# EAGLE design 4 Bit To 2 Digit Display (EAGLE 7.6.0)
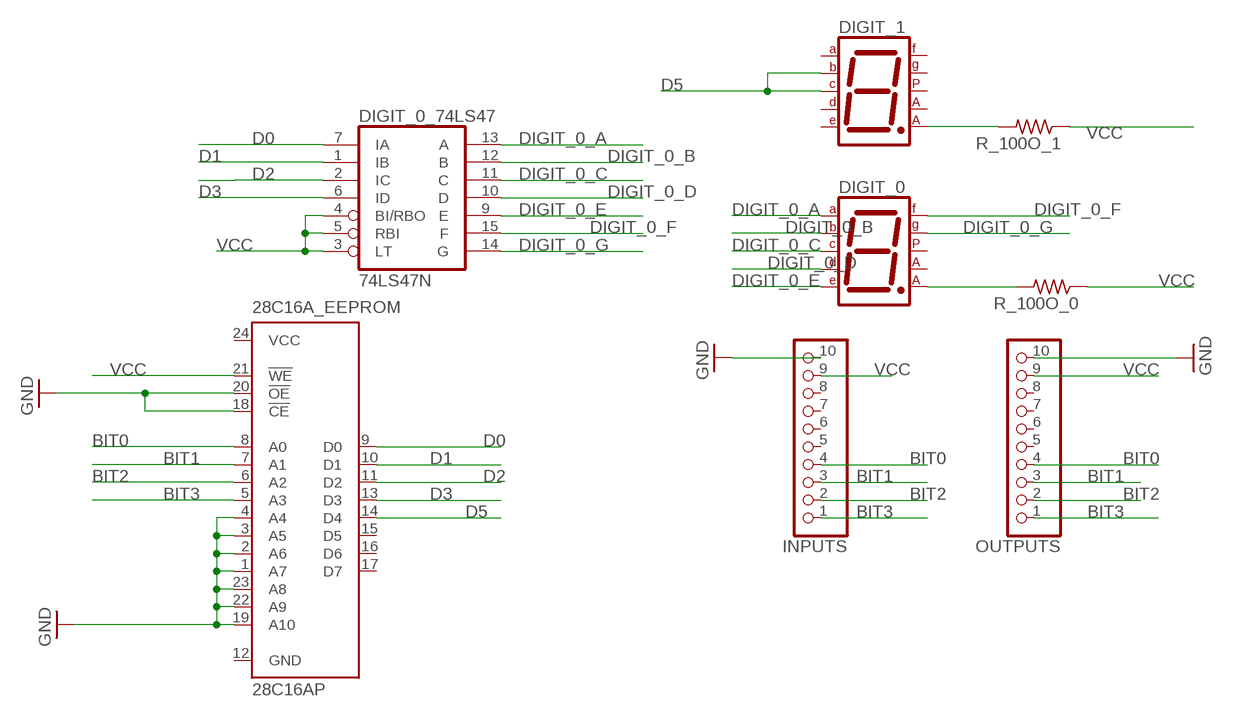
[diagram p0: schematic, sheet 1]

## Parts
28C16A_EEPROM  28C16AP  [DIL24-6]
DIGIT_0  7SEG-CA  [7SEG-13]
DIGIT_0_74LS47  74LS47N  [DIL16]
DIGIT_1  7SEG-CA  [7SEG-13]
INPUTS  PINHD-1X10  [1X10-BIG]
OUTPUTS  PINHD-1X10  [1X10-BIG]
R_100O_0  R-US_R1206  [R1206]
R_100O_1  R-US_R1206  [R1206]

## Nets
BIT0: 28C16A_EEPROM.8(A0) INPUTS.4 OUTPUTS.4
BIT1: 28C16A_EEPROM.7(A1) INPUTS.3 OUTPUTS.3
BIT2: 28C16A_EEPROM.6(A2) INPUTS.2 OUTPUTS.2
BIT3: 28C16A_EEPROM.5(A3) INPUTS.1 OUTPUTS.1
D0: 28C16A_EEPROM.9(D0) DIGIT_0_74LS47.7(IA)
D1: 28C16A_EEPROM.10(D1) DIGIT_0_74LS47.1(IB)
D2: 28C16A_EEPROM.11(D2) DIGIT_0_74LS47.2(IC)
D3: 28C16A_EEPROM.13(D3) DIGIT_0_74LS47.6(ID)
D5: 28C16A_EEPROM.14(D4) DIGIT_1.4(C) DIGIT_1.6(B)
DIGIT_0_A: DIGIT_0.7(A) DIGIT_0_74LS47.13(A)
DIGIT_0_B: DIGIT_0.6(B) DIGIT_0_74LS47.12(B)
DIGIT_0_C: DIGIT_0.4(C) DIGIT_0_74LS47.11(C)
DIGIT_0_D: DIGIT_0.2(D) DIGIT_0_74LS47.10(D)
DIGIT_0_E: DIGIT_0.1(E) DIGIT_0_74LS47.9(E)
DIGIT_0_F: DIGIT_0.9(F) DIGIT_0_74LS47.15(F)
DIGIT_0_G: DIGIT_0.10(G) DIGIT_0_74LS47.14(G)
GND: 28C16A_EEPROM.1(A7) 28C16A_EEPROM.2(A6) 28C16A_EEPROM.3(A5) 28C16A_EEPROM.4(A4) 28C16A_EEPROM.18(!CE) 28C16A_EEPROM.19(A10) 28C16A_EEPROM.20(!OE) 28C16A_EEPROM.22(A9) 28C16A_EEPROM.23(A8) INPUTS.10 OUTPUTS.10
N$1: DIGIT_0.8(CA2) R_100O_0.2
N$2: DIGIT_1.8(CA2) R_100O_1.2
VCC: 28C16A_EEPROM.21(!WE) DIGIT_0_74LS47.3(LT) DIGIT_0_74LS47.4(BI/RBO) DIGIT_0_74LS47.5(RBI) INPUTS.9 OUTPUTS.9 R_100O_0.1 R_100O_1.1
Unconnected: 28C16A_EEPROM.15(D5) 28C16A_EEPROM.16(D6) 28C16A_EEPROM.17(D7) DIGIT_0.3(CA1) DIGIT_0.5(DP) DIGIT_1.1(E) DIGIT_1.2(D) DIGIT_1.3(CA1) DIGIT_1.5(DP) DIGIT_1.7(A) DIGIT_1.9(F) DIGIT_1.10(G) INPUTS.5 INPUTS.6 INPUTS.7 INPUTS.8 OUTPUTS.5 OUTPUTS.6 OUTPUTS.7 OUTPUTS.8

## Power pins joined to a net without a drawn wire
GND: 28C16A_EEPROM.12(GND) DIGIT_0_74LS47.8(GND)
VCC: 28C16A_EEPROM.24(VCC) DIGIT_0_74LS47.16(VCC)

## Library data of the parts
28C16A_EEPROM = microchip:28*16A: CMOS EPROM 16 K (2 K x 8) Source: ww1.microchip.com/downloads/en/DeviceDoc/11125J.pdf; MPN: CAT28C16ALI-12; OC_FARNELL: 1718292; OC_NEWARK: 06R0648
DIGIT_0 DIGIT_1 = special:7SEG-CA: 7-segment DISPLAY single anode, 13 mm
DIGIT_0_74LS47 = 74xx-eu:74*47: BCD to seven segment DECODER/DRIVER Source: http://www.ee.washington.edu/stores/DataSheets/74ls/74ls47.pdf
INPUTS OUTPUTS = adafruit:PINHD-1X10: Pin header 1x10 0.1" spacing With round pins
R_100O_0 R_100O_1 = adafruit:R-US_: RESISTOR, American symbol

## Board
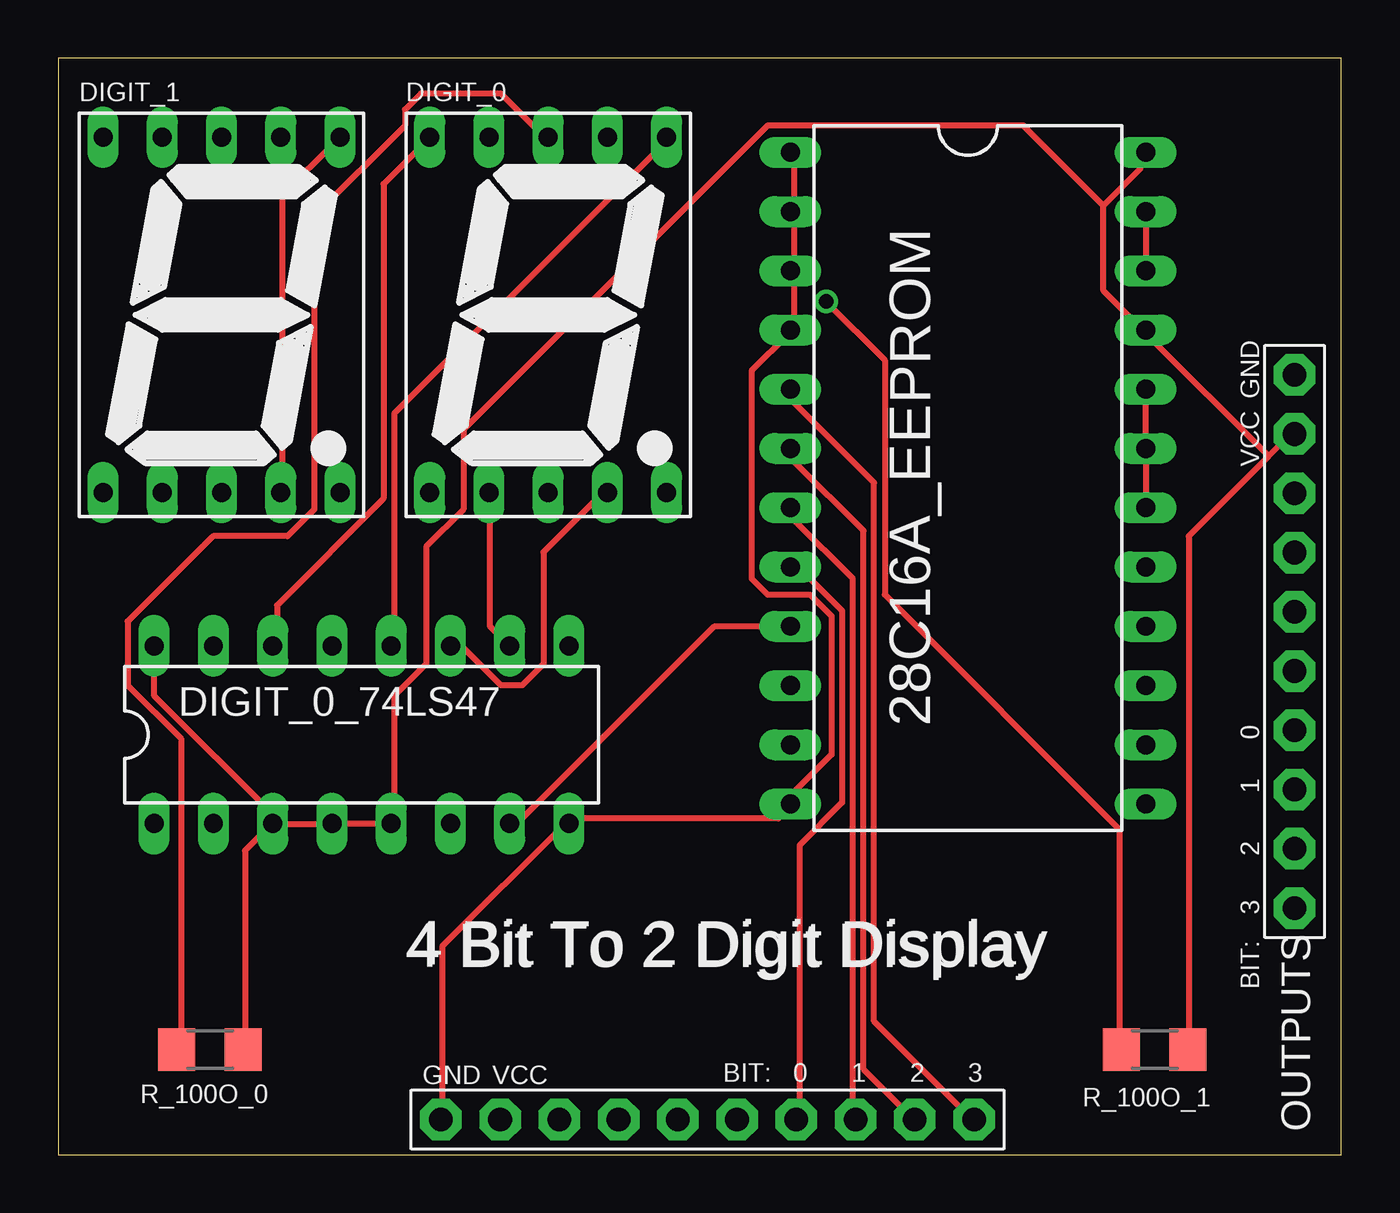
[diagram p1: board, top side]
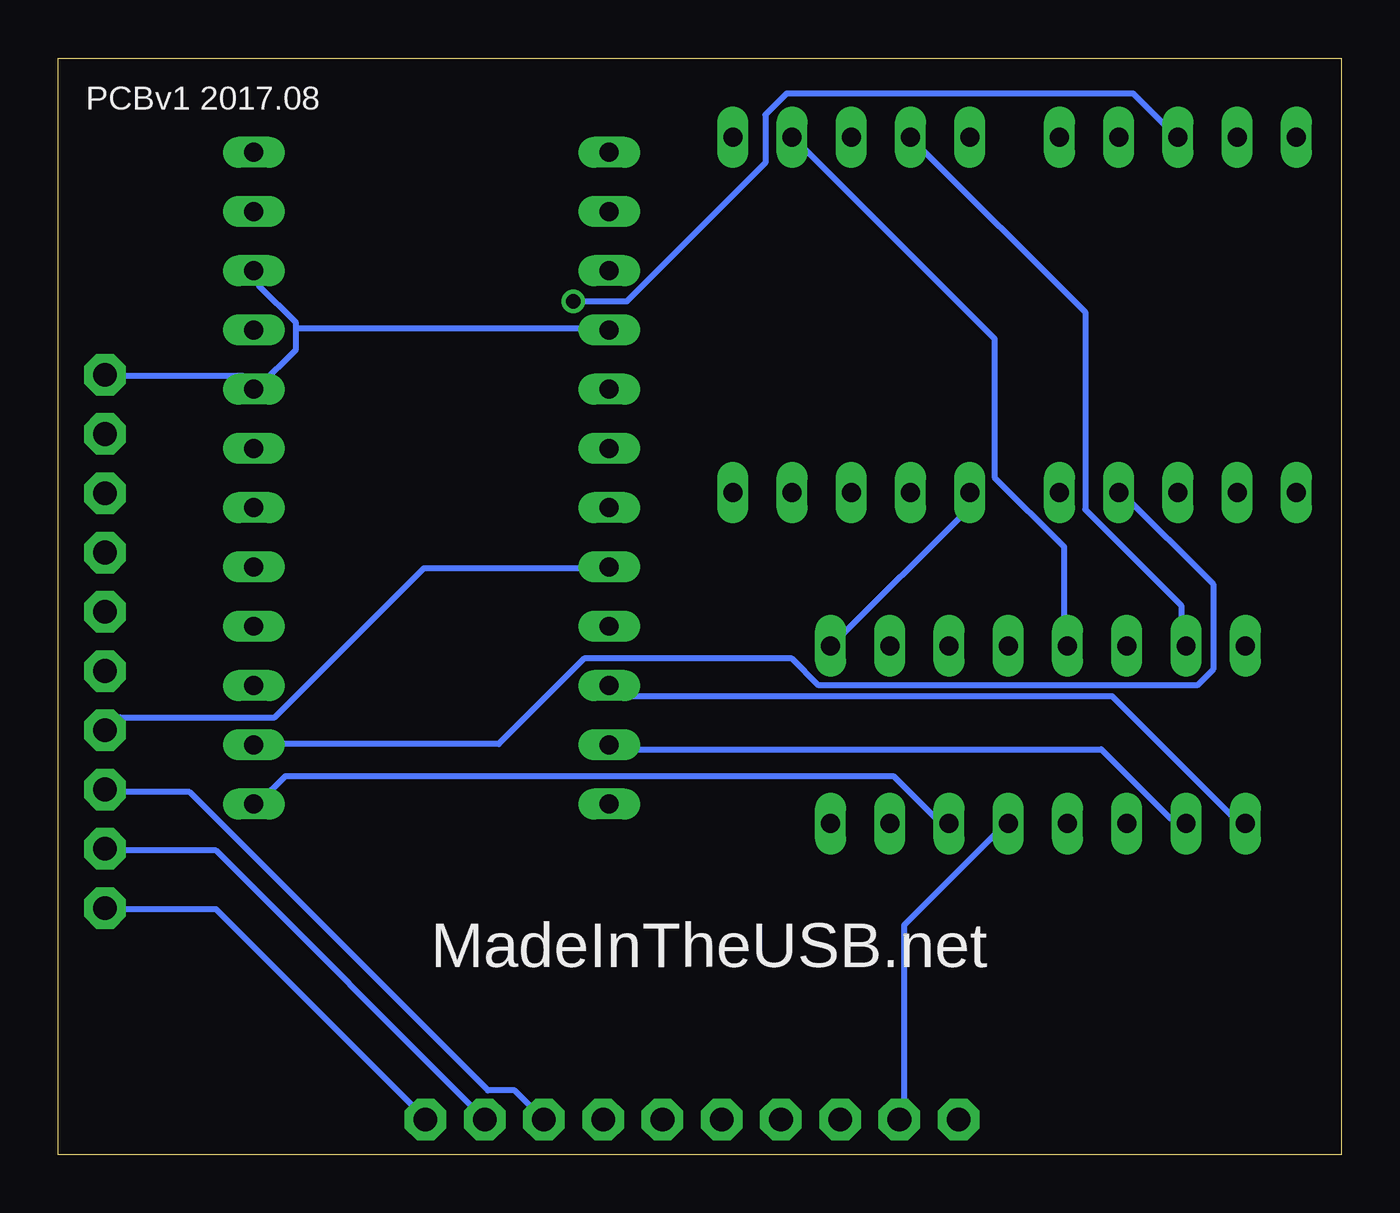
[diagram p2: board, bottom side, seen from below]

Size 55 x 47 mm. Coordinates in mm from the lower left corner, seen from the top.
Outline: 0,0 55,0 55,47 0,47 0,0
Copper layers (1*16): Top 0.035mm / dielectric 1.5mm / Bottom 0.035mm
Design rules "default": minimum track width 10mil, minimum drill 24mil, track to track 8mil, track to pad 8mil, pad to pad 8mil, via to via 8mil, smd to smd 8mil, copper to edge 40mil, drill to drill 8mil, minimum pad ring 10mil, minimum via ring 8mil, stop-mask expansion 4mil, vias tented up to drill 0mil, thermal gap 10mil

### Footprints (pad centres in the part's own frame; a part is rotated, then mirrored left to right if it is on the bottom)
DIL24-6 = drill 0.813 long: 1 -13.97,-7.62; 2 -11.43,-7.62; 3 -8.89,-7.62; 4 -6.35,-7.62; 5 -3.81,-7.62; 6 -1.27,-7.62; 7 1.27,-7.62; 8 3.81,-7.62; 9 6.35,-7.62; 10 8.89,-7.62; 11 11.43,-7.62; 12 13.97,-7.62; 13 13.97,7.62; 14 11.43,7.62; 15 8.89,7.62; 16 6.35,7.62; 17 3.81,7.62; 18 1.27,7.62; 19 -1.27,7.62; 20 -3.81,7.62; 21 -6.35,7.62; 22 -8.89,7.62; 23 -11.43,7.62; 24 -13.97,7.62
7SEG-13 = drill 0.813 long: 1 -5.08,-7.62; 2 -2.54,-7.62; 3 0,-7.62; 4 2.54,-7.62; 5 5.08,-7.62; 6 5.08,7.62; 7 2.54,7.62; 8 0,7.62; 9 -2.54,7.62; 10 -5.08,7.62
DIL16 = drill 0.813 long: 1 -8.89,-3.81; 2 -6.35,-3.81; 3 -3.81,-3.81; 4 -1.27,-3.81; 5 1.27,-3.81; 6 3.81,-3.81; 7 6.35,-3.81; 8 8.89,-3.81; 9 8.89,3.81; 10 6.35,3.81; 11 3.81,3.81; 12 1.27,3.81; 13 -1.27,3.81; 14 -3.81,3.81; 15 -6.35,3.81; 16 -8.89,3.81
1X10-BIG = drill 1.016 pad 1.778 octagon: 1 -11.43,0; 2 -8.89,0; 3 -6.35,0; 4 -3.81,0; 5 -1.27,0; 6 1.27,0; 7 3.81,0; 8 6.35,0; 9 8.89,0; 10 11.43,0
R1206 = smd 1.6 x 1.803: 1 -1.422,0; 2 1.422,0

### Placement (x,y rotation side)
28C16A_EEPROM  39,29 270 top
DIGIT_0  21,36 0 top
DIGIT_0_74LS47  13,18 0 top
DIGIT_1  7,36 0 top
INPUTS  27.83,1.5 180 top
OUTPUTS  53,22 90 top
R_100O_0  6.5,4.5 180 top
R_100O_1  47,4.5 180 top

### Tracks (layer width: path | path; a pad name or v marks a point on that pad's centre or on a via)
BIT0
  Top 0.254: INPUTS.4 31.77,1.6 31.77,13.26 33.6,15.09 33.6,23.32 31.55,25.38 28C16A_EEPROM.8
  Bottom 0.254: 28C16A_EEPROM.8 31.55,25.15 39.32,25.15 45.72,18.75 52.35,18.75 52.81,18.29 OUTPUTS.4
BIT1
  Top 0.254: 28C16A_EEPROM.7 31.55,27.66 31.55,27.2 34.06,24.69 34.06,1.6 INPUTS.3
  Bottom 0.254: OUTPUTS.3 52.81,15.54 49.38,15.54 36.58,2.74 35.43,2.74 34.29,1.6 INPUTS.3
BIT2
  Top 0.254: 28C16A_EEPROM.6 31.55,30.18 31.55,29.72 34.52,26.75 34.52,3.66 36.58,1.6 INPUTS.2
  Bottom 0.254: OUTPUTS.2 52.81,13.03 48.23,13.03 36.8,1.6 INPUTS.2
BIT3
  Top 0.254: 28C16A_EEPROM.5 31.55,32.69 31.55,32.23 34.98,28.8 34.98,5.71 39.09,1.6 INPUTS.1
  Bottom 0.254: OUTPUTS.1 52.81,10.52 48.23,10.52 39.32,1.6 INPUTS.1
D0
  Top 0.254: DIGIT_0_74LS47.7 19.43,14.4 19.89,14.4 28.12,22.63 31.32,22.63 28C16A_EEPROM.9
D1
  Bottom 0.254: DIGIT_0_74LS47.1 4.12,14.4 4.57,14.4 9.83,19.66 31.09,19.66 31.32,19.89 28C16A_EEPROM.10
D2
  Bottom 0.254: DIGIT_0_74LS47.2 6.86,14.4 7.32,14.4 10.29,17.37 31.32,17.37 28C16A_EEPROM.11
D3
  Bottom 0.254: DIGIT_0_74LS47.6 16.92,14.4 17.37,14.4 19.2,16.23 45.26,16.23 46.41,15.09 28C16A_EEPROM.13
D5
  Top 0.254: DIGIT_1.4 9.6,28.57 9.6,41.15 11.89,43.43 DIGIT_1.6
  Bottom 0.254: 28C16A_EEPROM.14 46.41,17.6 36.12,17.6 32.46,21.26 23.55,21.26 22.4,20.12 6.17,20.12 5.49,20.8 5.49,24.46 9.37,28.35 DIGIT_1.4
DIGIT_0_A
  Bottom 0.254: DIGIT_0_74LS47.13 11.89,21.95 11.89,26.06 14.86,29.03 14.86,34.98 23.32,43.43 DIGIT_0.7
DIGIT_0_B
  Top 0.254: DIGIT_0_74LS47.12 14.4,21.95 14.4,31.77 26.06,43.43 DIGIT_0.6
DIGIT_0_C
  Top 0.254: DIGIT_0_74LS47.11 16.92,21.72 17.37,21.72 18.97,20.12 19.89,20.12 20.8,21.03 20.8,25.83 23.32,28.35 DIGIT_0.4
DIGIT_0_D
  Top 0.254: DIGIT_0.2 18.52,28.35 18.52,22.63 19.2,21.95 DIGIT_0_74LS47.10
DIGIT_0_E
  Bottom 0.254: DIGIT_0.1 16,28.35 16,27.66 21.72,21.95 DIGIT_0_74LS47.9
DIGIT_0_F
  Bottom 0.254: DIGIT_0_74LS47.15 6.86,21.95 6.86,23.55 10.97,27.66 10.97,36.12 18.29,43.43 DIGIT_0.9
DIGIT_0_G
  Top 0.254: DIGIT_0_74LS47.14 9.37,21.95 9.37,23.55 13.95,28.12 13.95,41.6 15.77,43.43 DIGIT_0.10
GND
  Top 0.254: INPUTS.10 16.46,1.6 16.46,8.91 21.72,14.17 DIGIT_0_74LS47.8 21.95,14.4 30.86,14.4 31.32,14.86 28C16A_EEPROM.12 31.55,15.09 31.55,15.54 33.15,17.14 33.15,23.09 32.23,24 30.4,24 29.72,24.69 29.72,33.6 31.32,35.2 28C16A_EEPROM.4 31.55,35.43 31.55,37.72 28C16A_EEPROM.3 31.55,37.95 31.55,40.23 28C16A_EEPROM.2 31.55,40.46 31.55,42.75 28C16A_EEPROM.1 | 28C16A_EEPROM.22 46.63,37.95 46.63,40.23 28C16A_EEPROM.23 | 28C16A_EEPROM.18 46.63,27.89 46.63,30.18 28C16A_EEPROM.19 46.63,30.4 46.63,32.69 28C16A_EEPROM.20
  Bottom 0.254: 44.81,35.43 44.81,34.52 46.41,32.92 28C16A_EEPROM.20 46.63,32.92 47.09,33.38 52.81,33.38 OUTPUTS.10 | 44.81,35.43 44.81,35.66 46.41,37.26 46.41,37.72 28C16A_EEPROM.22 | 44.81,35.43 31.55,35.43 28C16A_EEPROM.4
N$1
  Top 0.254: R_100O_0.2 5.26,4.57 5.26,17.83 2.97,20.12 2.97,22.86 6.63,26.52 9.83,26.52 10.97,27.66 10.97,40.23 14.86,44.12 14.86,44.81 15.54,45.49 18.97,45.49 20.8,43.66 DIGIT_0.8
N$2  (via drill 0.61)
  Top 0.254: v32.92,36.58 35.43,34.06 35.43,24 45.49,13.95 45.49,4.57 R_100O_1.2
  Bottom 0.254: v32.92,36.58 30.63,36.58 24.69,42.52 24.69,44.58 23.77,45.49 8.91,45.49 7.09,43.66 DIGIT_1.8
VCC
  Top 0.254: R_100O_0.1 8,4.57 8,13.03 9.14,14.17 DIGIT_0_74LS47.3 | DIGIT_0_74LS47.16 4.12,21.72 4.12,19.66 9.37,14.4 DIGIT_0_74LS47.3 | DIGIT_0_74LS47.3 9.37,14.17 11.66,14.17 DIGIT_0_74LS47.4 11.89,14.17 14.17,14.17 DIGIT_0_74LS47.5 14.4,14.4 14.4,19.66 15.77,21.03 15.77,26.06 17.37,27.66 17.37,31.09 30.4,44.12 41.38,44.12 44.81,40.69 | 51.89,29.95 52.81,30.86 OUTPUTS.9 | 51.89,29.95 48.46,26.52 48.46,4.57 R_100O_1.1 | 51.89,29.95 46.63,35.2 28C16A_EEPROM.21 46.41,35.43 44.81,37.03 44.81,40.69 | 44.81,40.69 46.41,42.29 46.41,42.75 28C16A_EEPROM.24
  Bottom 0.254: INPUTS.9 18.75,1.6 18.75,9.83 14.4,14.17 DIGIT_0_74LS47.5

### Text on the board
tNames: GND | VCC | 0 | 1 | 2 | 3 | 4 Bit To 2 Digit Display | 4 Bit To 2 Digit Display | BIT: | GND | VCC | BIT: | 0 | 1 | 2 | 3
bNames: PCBv1 2017.08 | MadeInTheUSB.net